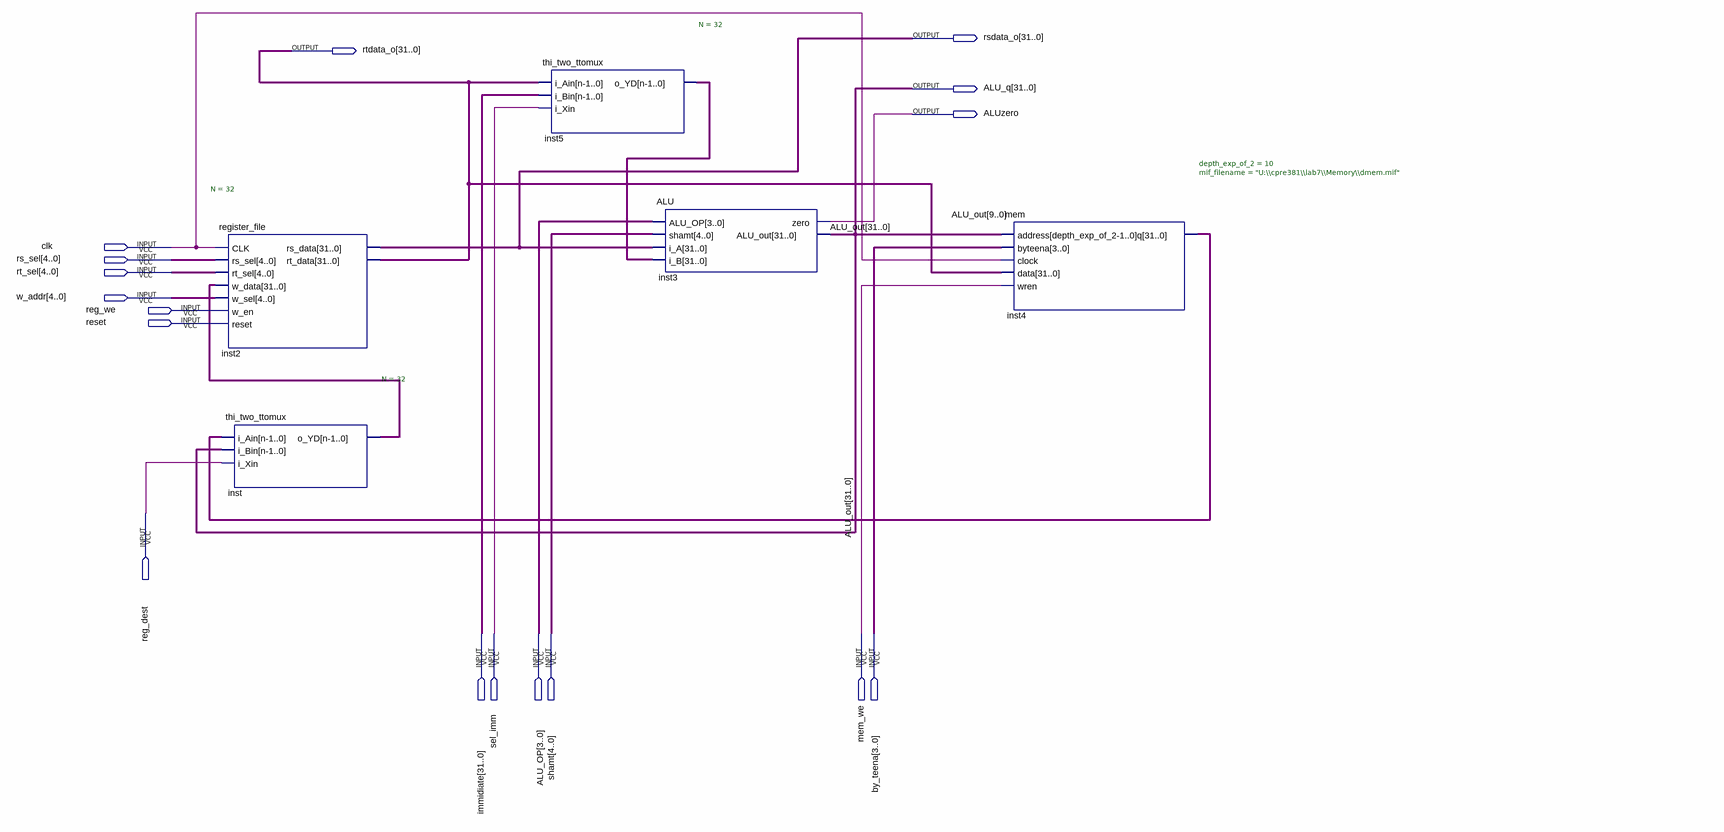
[diagram p0: schematic sheet]
// Quartus schematic lab7.bdf as structural Verilog: 5 symbols, 17 pins
module lab7 (
  input  clk,
  input  [4:0] rs_sel,
  input  [4:0] rt_sel,
  input  [4:0] w_addr,
  input  reg_we,
  input  reset,
  input  reg_dest,
  input  [31:0] immidiate,
  input  sel_imm,
  input  [3:0] ALU_OP,
  input  [4:0] shamt,
  input  mem_we,
  input  [3:0] by_teena,
  output [31:0] rsdata_o,
  output [31:0] rtdata_o,
  output [31:0] ALU_q,
  output ALUzero
);

  wire [31:0] inst4_q, inst5_o_yd, inst_o_yd;

  register_file #(.N(32)) inst2 (
    .CLK(clk), .rs_sel(rs_sel), .rt_sel(rt_sel), .w_data(inst_o_yd), .w_sel(w_addr), .w_en(reg_we),
    .reset(reset), .rs_data(rsdata_o), .rt_data(rtdata_o));
  thi_two_ttomux #(.N(32)) inst (.i_Ain(inst4_q), .i_Bin(ALU_q), .i_Xin(reg_dest), .o_YD(inst_o_yd));
  thi_two_ttomux #(.N(32)) inst5 (.i_Ain(rtdata_o), .i_Bin(immidiate), .i_Xin(sel_imm), .o_YD(inst5_o_yd));
  ALU inst3 (.ALU_OP(ALU_OP), .shamt(shamt), .i_A(rsdata_o), .i_B(inst5_o_yd), .zero(ALUzero), .ALU_out(ALU_q));
  mem #(.depth_exp_of_2(10), .mif_filename("U:\\cpre381\\lab7\\Memory\\dmem.mif")) inst4 (
    .address(ALU_q[9:0]), .byteena(by_teena), .clock(clk), .data(rtdata_o), .wren(mem_we), .q(inst4_q));

  // Other names for the same wires on the sheet: ALU_out[31:0] = ALU_q
endmodule
